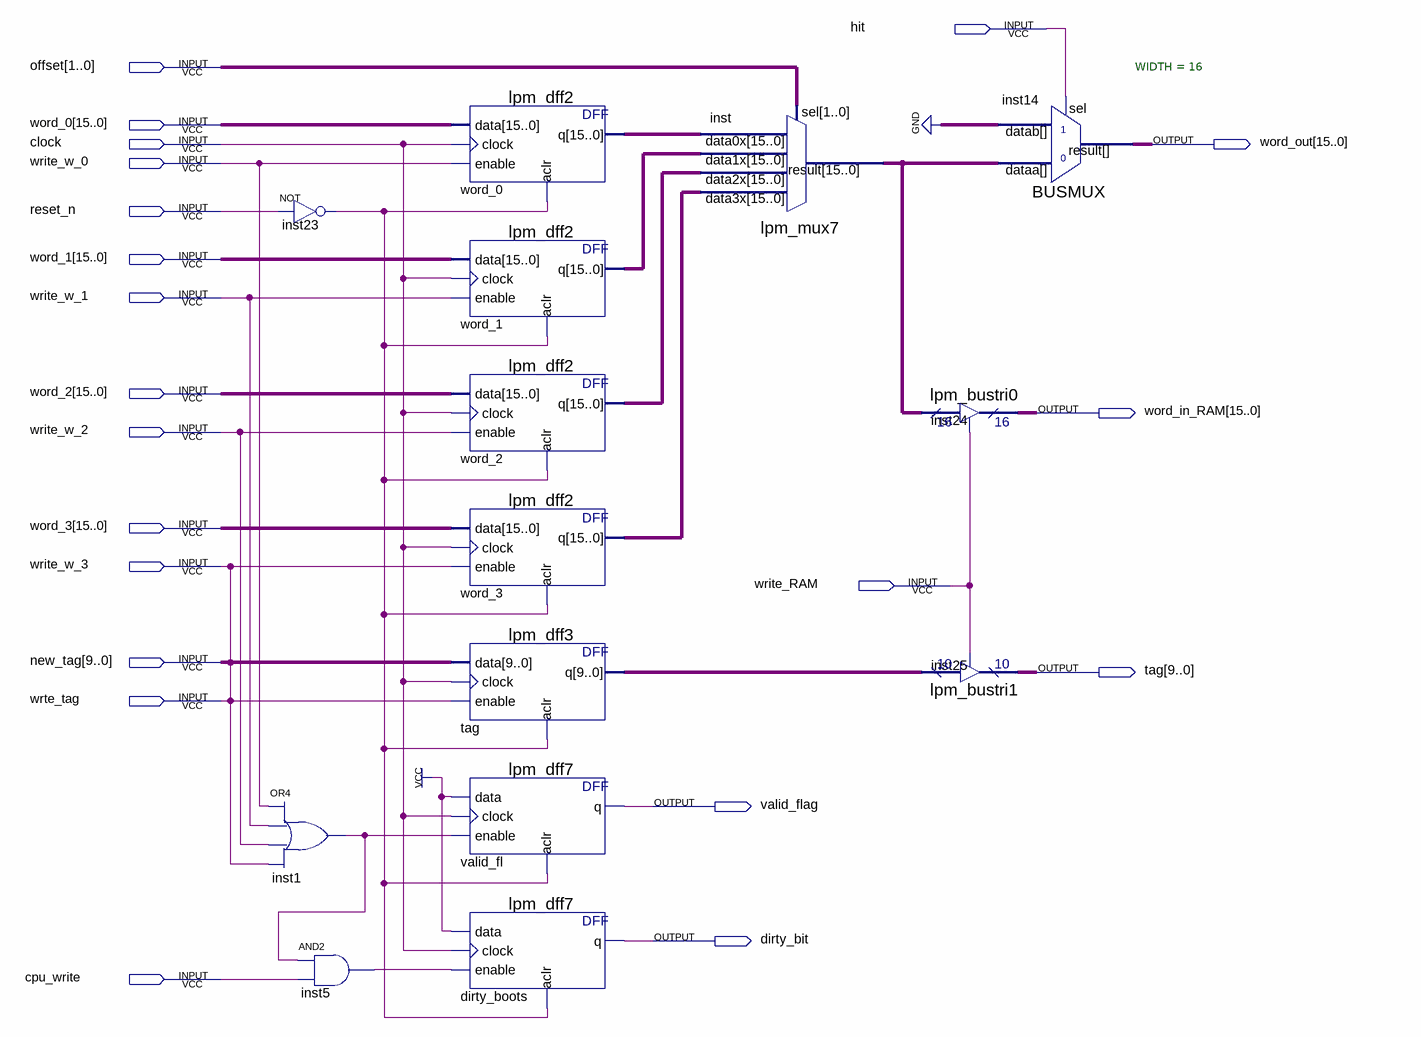
[diagram p0: schematic sheet]
// Quartus schematic cache_row_memory.bdf as structural Verilog: 14 symbols, 21 pins
module cache_row_memory (
  input  hit,
  input  [1:0] offset,
  input  [15:0] word_0,
  input  clock,
  input  write_w_0,
  input  reset_n,
  input  [15:0] word_1,
  input  write_w_1,
  input  [15:0] word_2,
  input  write_w_2,
  input  [15:0] word_3,
  input  write_w_3,
  input  write_RAM,
  input  [9:0] new_tag,
  input  wrte_tag,
  input  cpu_write,
  output [15:0] word_out,
  output [15:0] word_in_RAM,
  output [9:0] tag,
  output valid_flag,
  output dirty_bit
);

  wire inst1_out, inst5_out, inst23_out;
  wire [9:0] tag_q;
  wire [15:0] inst_result, word_0_q, word_1_q, word_2_q, word_3_q;

  not inst23 (inst23_out, reset_n);
  or inst1 (inst1_out, write_w_0, write_w_1, write_w_2, wrte_tag);
  and inst5 (inst5_out, inst1_out, cpu_write);
  lpm_dff2 u_word_0 (.data(word_0), .clock(clock), .enable(write_w_0), .aclr(inst23_out), .q(word_0_q));
  lpm_dff2 u_word_1 (.data(word_1), .clock(clock), .enable(write_w_1), .aclr(inst23_out), .q(word_1_q));
  lpm_dff2 u_word_2 (.data(word_2), .clock(clock), .enable(write_w_2), .aclr(inst23_out), .q(word_2_q));
  lpm_dff2 u_word_3 (.data(word_3), .clock(clock), .enable(write_w_3), .aclr(inst23_out), .q(word_3_q));
  lpm_dff3 u_tag (.data(new_tag), .clock(clock), .enable(wrte_tag), .aclr(inst23_out), .q(tag_q));
  lpm_dff7 valid_fl (.data(1'b1), .clock(clock), .enable(inst1_out), .aclr(inst23_out), .q(valid_flag));
  lpm_dff7 dirty_boots (.data(1'b1), .clock(clock), .enable(inst5_out), .aclr(inst23_out), .q(dirty_bit));
  lpm_mux7 inst (
    .data3x(word_3_q), .data2x(word_2_q), .data1x(word_1_q), .data0x(word_0_q), .sel(offset),
    .result(inst_result));
  lpm_bustri0 inst24 (.enabledt(write_RAM), .data(inst_result), .tridata(word_in_RAM));
  lpm_bustri1 inst25 (.enabledt(write_RAM), .data(tag_q), .tridata(tag));
  BUSMUX #(.WIDTH(16)) inst14 (.datab({16{1'b0}}), .sel(hit), .dataa(inst_result), .result(word_out));
endmodule
